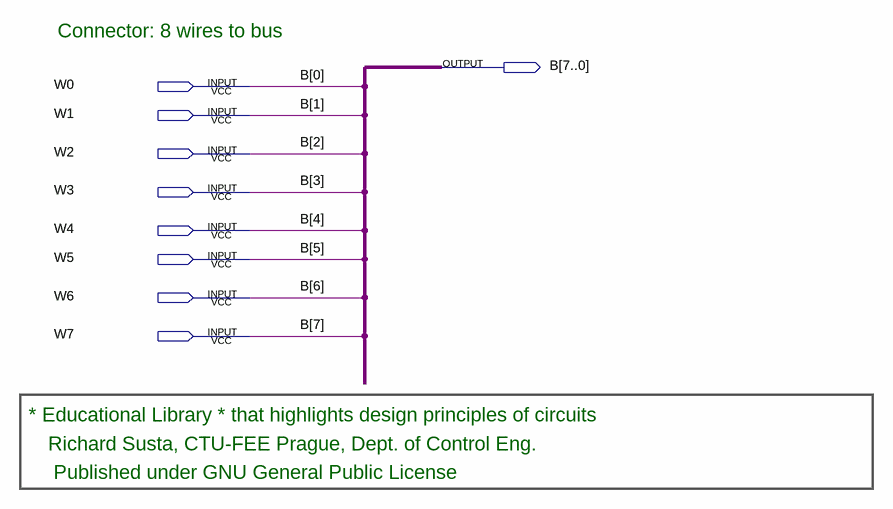
[diagram p0: schematic sheet]
// Quartus schematic join8wires.bdf as structural Verilog: 0 symbols, 9 pins
module join8wires (
  input  W0,
  input  W1,
  input  W2,
  input  W3,
  input  W4,
  input  W5,
  input  W6,
  input  W7,
  output [7:0] B
);


  assign B = {W7, W6, W5, W4, W3, W2, W1, W0};

  // Notes on the sheet:
  //   Connector: 8 wires to bus
  //   * Educational Library * that highlights design principles of circuits
  //   Richard Susta, CTU-FEE Prague, Dept. of Control Eng. 
  //    Published under GNU General Public License
endmodule
